# Altium schematic sheet sim part 2.SchDoc
size A4
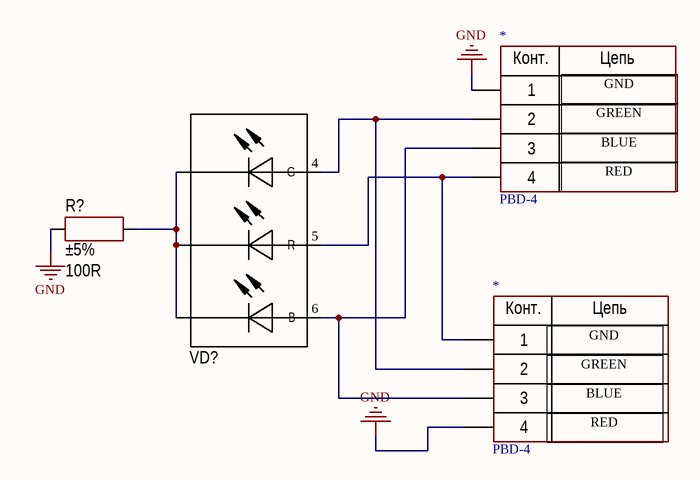
[diagram p0: sim part 2.SchDoc]

## Parts
(Parts that share a designator on the sheet are numbered #1, #2 ... from top to bottom, then left to right.)
*#1  PBD-4  [PBD-4-RIGHT]
*#2  PBD-4  [PLD-4-R]
R?  value 100R  Tolerance: ±5%  [RES: 0603]
VD?  VD?  [RGB]  (value not drawn)

## Nets
GND: *#1.1 *#2.4 R?.2
Net*#1_2: *#1.2 *#2.2 VD?.4(G)
Net*#1_3: *#1.3 *#2.3 VD?.6(B)
Net*#1_4: *#1.4 *#2.1 VD?.5(R)
NetR?_1: R?.1 VD?.1(G) VD?.2(G) VD?.3(G)

## Notes on the sheet
- GND
- GREEN
- BLUE
- RED
- (near *#2) GND
- (near *#2) GREEN
- (near *#2) BLUE
- (near *#2) RED
- (in symbol PBD-4) Конт.; Цепь

## Library data of the parts
R? = Resistor_0603: Manufacturer: Yageo; PartNumber: RC0603JR-07100RL; ValueManufacturerPartNumber: Resistor film, 100R, ±5%, 0603, 0.1W, -55...+125°C; TypeResistor: Resistor film; Power: 0.1W; Package: 0603; HelpURL: https://www.digikey.com/product-detail/en/yageo/RC0603JR-07100RL/311-100GRCT-ND/729644; Temperature: -55...+125°C
VD? = RGB